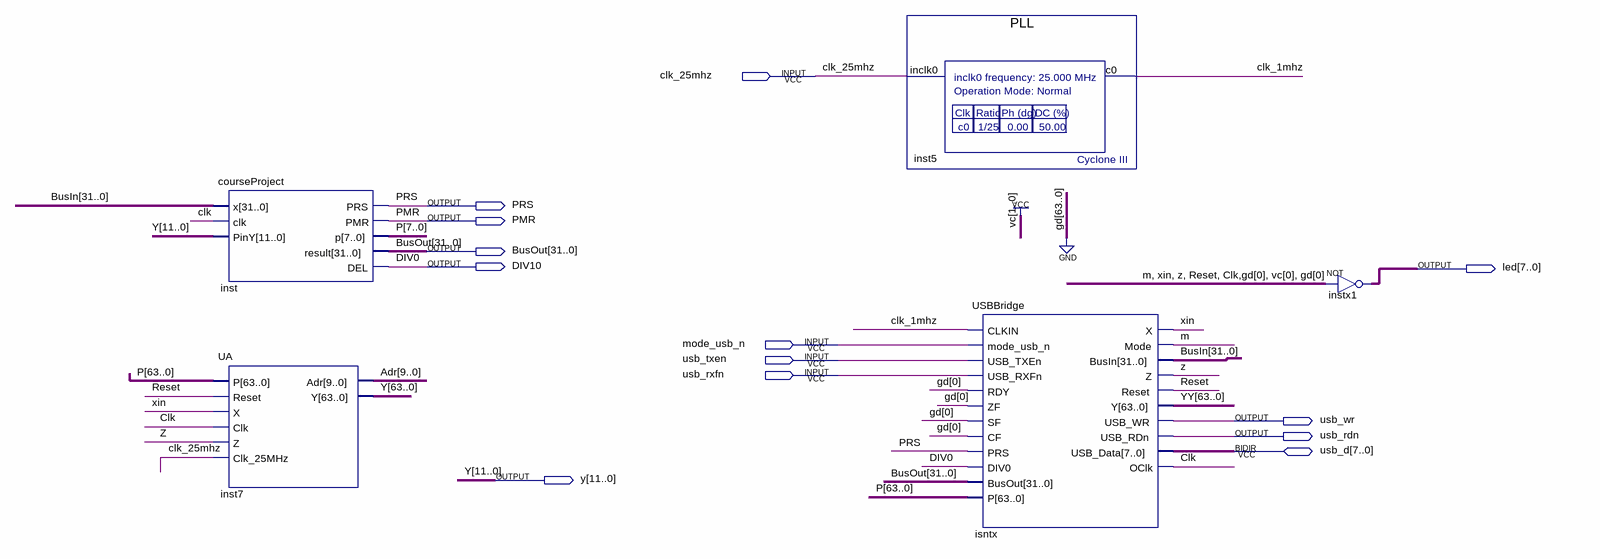
[diagram p0: schematic sheet]
// Quartus schematic Lab1Full.bdf as structural Verilog: 5 symbols, 13 pins
module Lab1Full (
  input  clk_25mhz,
  input  mode_usb_n,
  input  usb_txen,
  input  usb_rxfn,
  inout  [7:0] usb_d,
  output PRS,
  output PMR,
  output [31:0] BusOut,
  output DIV10,
  output [7:0] led,
  output usb_wr,
  output usb_rdn,
  output [63:0] y
);

  wire Clk, clk_1mhz, m, Reset, xin, Z;
  wire [9:0] Adr;
  wire [31:0] BusIn;
  wire [63:0] P, YY;

  courseProject inst (
    .x(BusIn), .clk(Clk), .PinY(y[11:0]), .PRS(PRS), .PMR(PMR), .p(P[7:0]), .result(BusOut), .DEL(DIV10));
  UA inst7 (.P(P), .Reset(Reset), .X(xin), .Clk(Clk), .Z(Z), .Clk_25MHz(clk_25mhz), .Adr(Adr), .Y(y));
  PLL inst5 (.inclk0(clk_25mhz), .c0(clk_1mhz));
  USBBridge isntx (
    .CLKIN(clk_1mhz), .mode_usb_n(mode_usb_n), .USB_TXEn(usb_txen), .USB_RXFn(usb_rxfn), .RDY(1'b0),
    .ZF(1'b0), .SF(1'b0), .CF(1'b0), .PRS(PRS), .DIV0(DIV10), .BusOut(BusOut), .P(P), .X(xin), .Mode(m),
    .BusIn(BusIn), .Z(Z), .Reset(Reset), .Y(YY), .USB_WR(usb_wr), .USB_RDn(usb_rdn), .OClk(Clk),
    .USB_Data(usb_d));
  assign led = ~{m, xin, Z, Reset, Clk, 3'b010};  // NOT instx1, 8 bits wide

  // Other names for the same wires on the sheet: DIV0 = DIV10
endmodule
